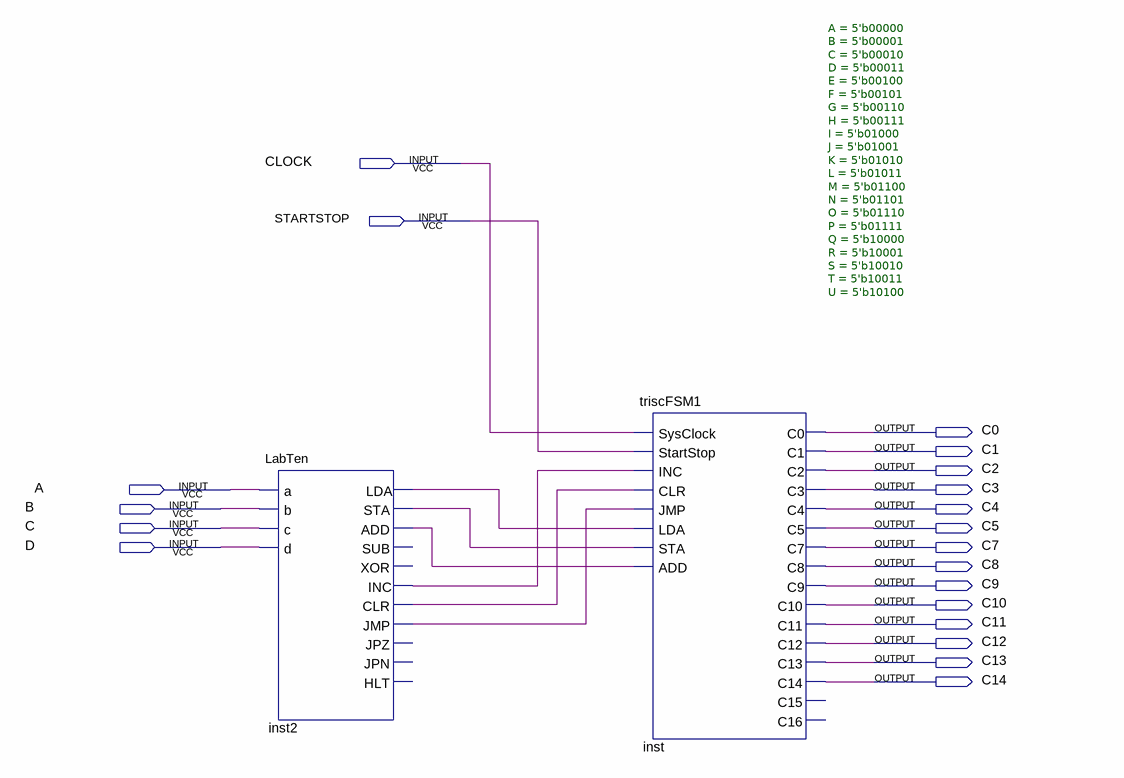
[diagram p0: schematic sheet]
// Quartus schematic ControlUnit.bdf as structural Verilog: 2 symbols, 20 pins
module ControlUnit (
  input  CLOCK,
  input  STARTSTOP,
  input  A,
  input  B,
  input  C,
  input  D,
  output C0,
  output C1,
  output C2,
  output C3,
  output C4,
  output C5,
  output C7,
  output C8,
  output C9,
  output C10,
  output C11,
  output C12,
  output C13,
  output C14
);

  wire inst2_add, inst2_clr, inst2_inc, inst2_jmp, inst2_lda, inst2_sta;

  LabTen inst2 (
    .a(A), .b(B), .c(C), .d(D), .LDA(inst2_lda), .STA(inst2_sta), .ADD(inst2_add), .INC(inst2_inc),
    .CLR(inst2_clr), .JMP(inst2_jmp));  // open: SUB, XOR, JPZ, JPN, HLT
  triscFSM1 #(.A(5'b00000), .B(5'b00001), .C(5'b00010), .D(5'b00011), .E(5'b00100), .F(5'b00101), .G(5'b00110), .H(5'b00111), .I(5'b01000), .J(5'b01001), .K(5'b01010), .L(5'b01011), .M(5'b01100), .N(5'b01101), .O(5'b01110), .P(5'b01111), .Q(5'b10000), .R(5'b10001), .S(5'b10010), .T(5'b10011), .U(5'b10100)) inst (
    .SysClock(CLOCK), .StartStop(STARTSTOP), .INC(inst2_inc), .CLR(inst2_clr), .JMP(inst2_jmp),
    .LDA(inst2_lda), .STA(inst2_sta), .ADD(inst2_add), .C0(C0), .C1(C1), .C2(C2), .C3(C3), .C4(C4), .C5(C5),
    .C7(C7), .C8(C8), .C9(C9), .C10(C10), .C11(C11), .C12(C12), .C13(C13), .C14(C14));  // open: C15, C16
endmodule
